# Altium schematic sheet gyro.SchDoc
size A4; SheetNumber: 7; SheetTotal: 7
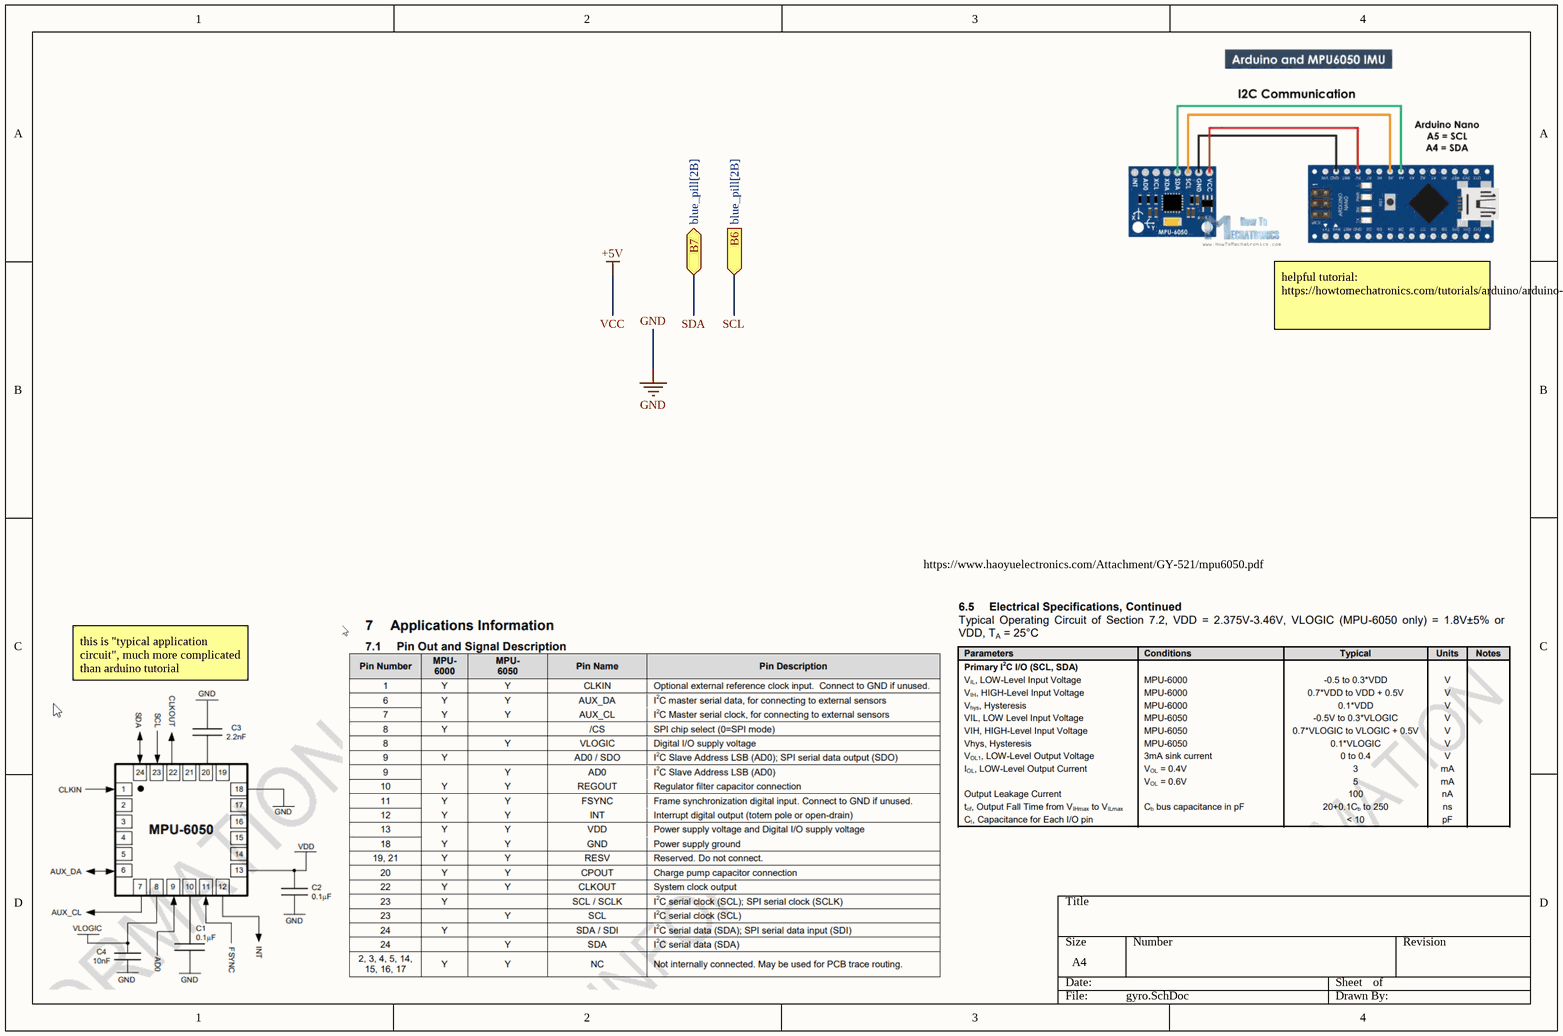
[diagram p0: gyro.SchDoc]

## Ports
B6 (in, see blue_pill[2B]), B7 (bidir, see blue_pill[2B])

## Nets
SCL: port B6
SDA: port B7

## Notes on the sheet
- helpful tutorial: https://howtomechatronics.com/tutorials/arduino/arduino-and-mpu6050-accelerometer-and-gyroscope-tutorial/
- https://www.haoyuelectronics.com/Attachment/GY-521/mpu6050.pdf
- this is "typical application circuit", much more complicated than arduino tutorial